# EAGLE design Iridium_9603N_Solar_Beacon (EAGLE 9.2.2)

## Sheet 1 of 4
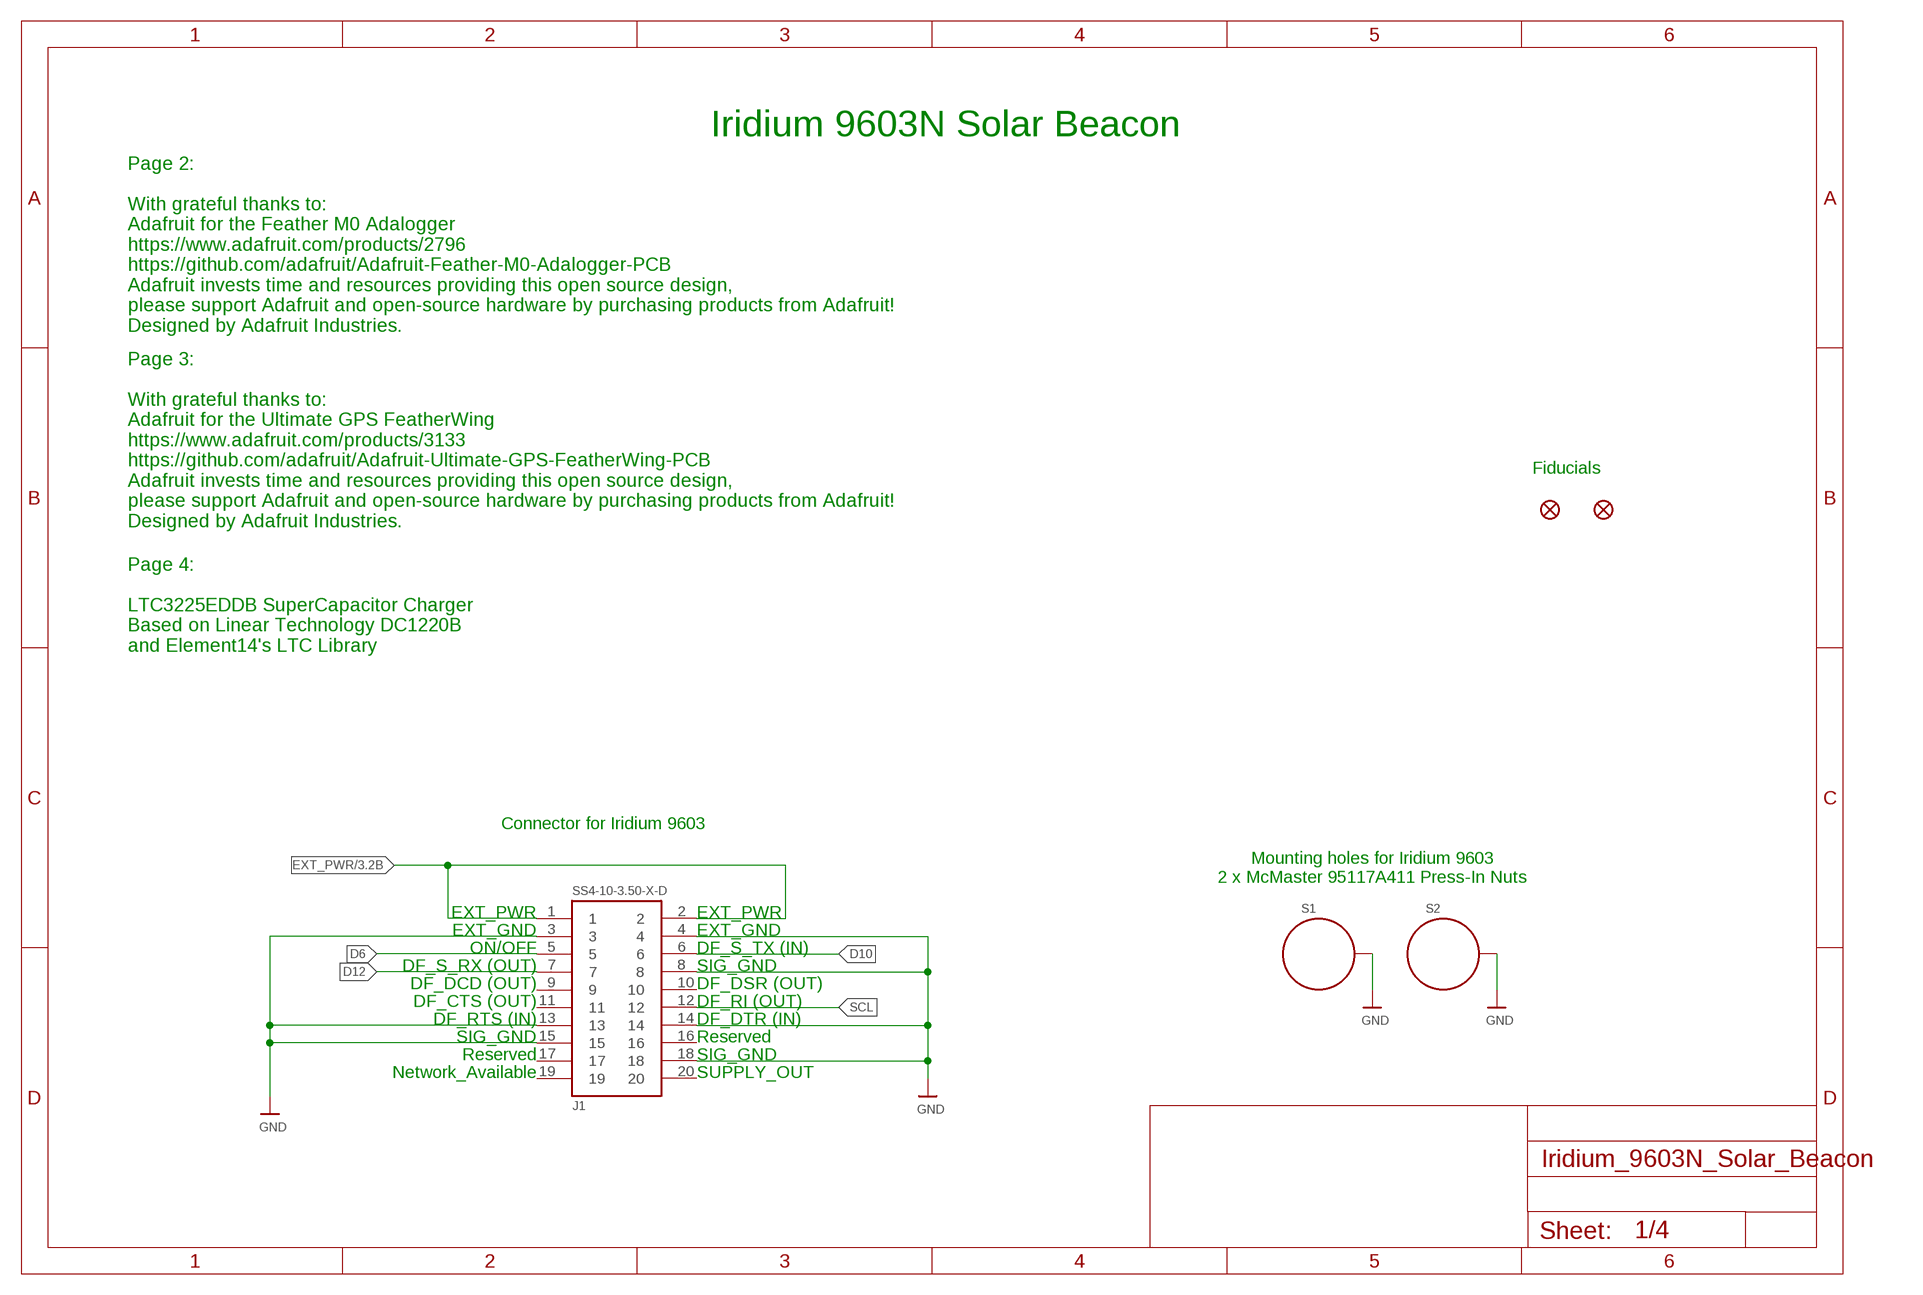
[diagram p0: schematic, sheet 1]

### Parts
FD1  FIDUCIAL1X2  [FIDUCIAL-1X2]
FD2  FIDUCIAL1X2  [FIDUCIAL-1X2]
J1  SS4-10-3.50-X-D  [SS4-10-3.50-X-D]
S1  STANDOFF_ELECTRICALMCMASTER-95117A411  [STANDOFF-ELECTRICAL-MCMASTER-95117A411]
S2  STANDOFF_ELECTRICALMCMASTER-95117A411  [STANDOFF-ELECTRICAL-MCMASTER-95117A411]

### Nets
D6: J1.5 ; also sheet 2
D10: J1.6 ; also sheet 2
D12: J1.7 ; also sheet 2
EXT_PWR: J1.1 J1.2 ; also sheet 3,4
GND: J1.3 J1.4 J1.8 J1.13 J1.14 J1.15 J1.18 S1.P1 S2.P1 ; also sheet 2,3,4
SCL: J1.12 ; also sheet 2
Unconnected: J1.9 J1.10 J1.11 J1.16 J1.17 J1.19 J1.20

### Notes on the sheet
- Iridium 9603N Solar Beacon
- Page 2:
  
  With grateful thanks to:
  Adafruit for the Feather M0 Adalogger
  https://www.adafruit.com/products/2796
  https://github.com/adafruit/Adafruit-Feather-M0-Adalogger-PCB
  Adafruit invests time and resources providing this open source design,
  please support Adafruit and open-source hardware by purchasing products from Adafruit!
  Designed by Adafruit Industries.
- Fiducials
- Page 3:
  
  With grateful thanks to:
  Adafruit for the Ultimate GPS FeatherWing
  https://www.adafruit.com/products/3133
  https://github.com/adafruit/Adafruit-Ultimate-GPS-FeatherWing-PCB
  Adafruit invests time and resources providing this open source design,
  please support Adafruit and open-source hardware by purchasing products from Adafruit!
  Designed by Adafruit Industries.
- Page 4:
  
  LTC3225EDDB SuperCapacitor Charger
  Based on Linear Technology DC1220B
  and Element14's LTC Library
- Connector for Iridium 9603
- Mounting holes for Iridium 9603
  2 x McMaster 95117A411 Press-In Nuts
- EXT_PWR | EXT_PWR
- EXT_GND | EXT_GND
- ON/OFF | DF_S_TX (IN)
- DF_S_RX (OUT) | SIG_GND
- DF_DCD (OUT) | DF_DSR (OUT)
- DF_CTS (OUT) | DF_RI (OUT)
- DF_RTS (IN) | DF_DTR (IN)
- SIG_GND | Reserved
- Reserved | SIG_GND
- Network_Available | SUPPLY_OUT

## Sheet 2 of 4
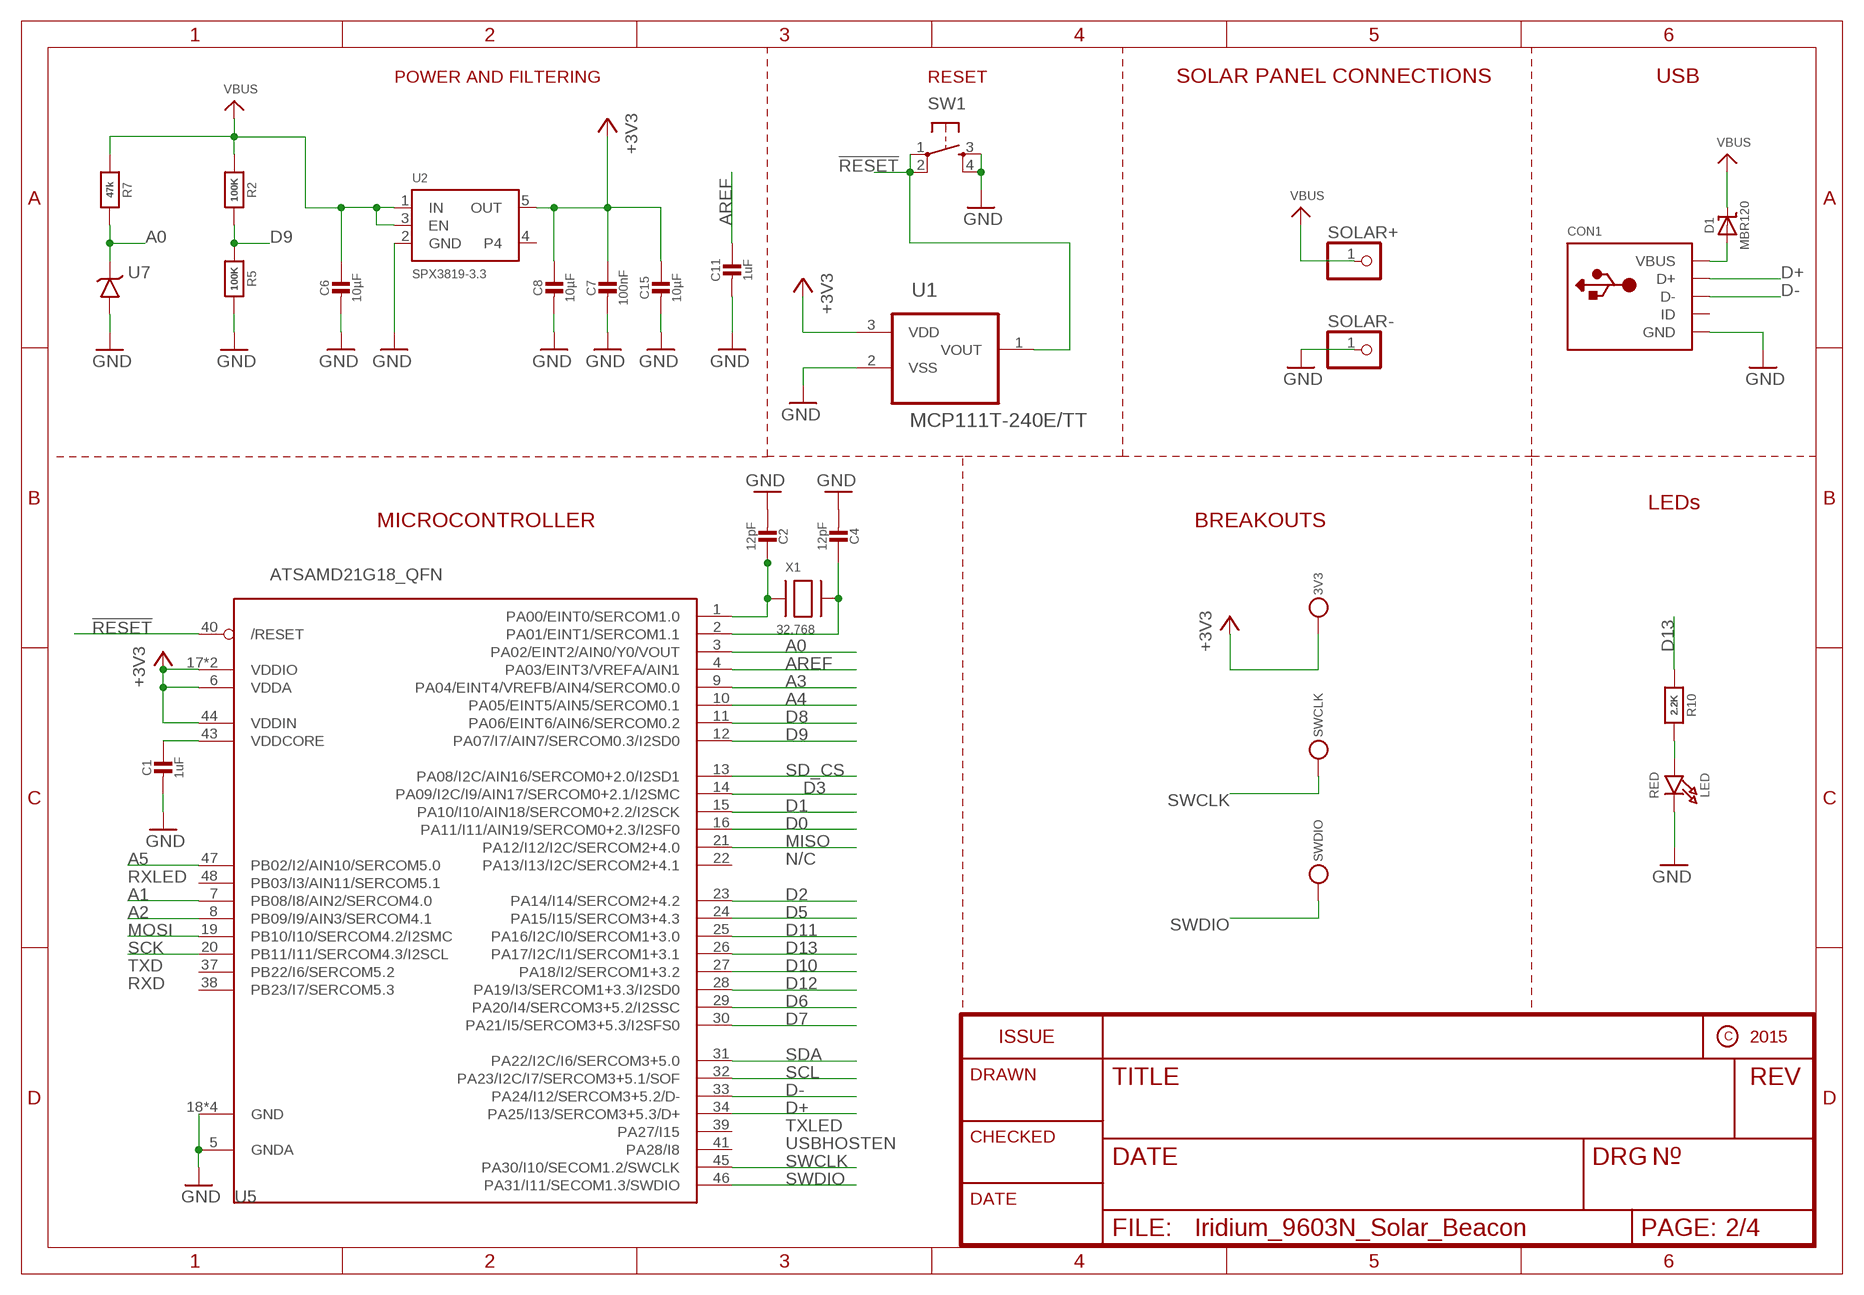
[diagram p1: schematic, sheet 2]

### Parts
3V3  TESTPOINTROUND1.5MM  [TESTPOINT_ROUND_1.5MM]
C1  1uF  CAP_CERAMIC0603_NO  [0603-NO]
C2  12pF  CAP_CERAMIC0603_NO  [0603-NO]
C4  12pF  CAP_CERAMIC0603_NO  [0603-NO]
C6  10µF  CAP_CERAMIC0805-NOOUTLINE  [0805-NO]
C7  100nF  CAP_CERAMIC0603_NO  [0603-NO]
C8  10µF  CAP_CERAMIC0805-NOOUTLINE  [0805-NO]
C11  1uF  CAP_CERAMIC0603_NO  [0603-NO]
C15  10µF  CAP_CERAMIC0805-NOOUTLINE  [0805-NO]
CON1  MICROBUILDER_USBFCI_10103594_CORRECTED  [MICROBUILDER_FCI_10103594_CORRECTED]
D1  MBR120  DIODE-SCHOTTKYSOD-123  [SOD-123]
LED  RED  LED0805_NOOUTLINE  [CHIPLED_0805_NOOUTLINE]
R2  100K  RESISTOR_0603_NOOUT  [0603-NO]
R5  100K  RESISTOR_0603_NOOUT  [0603-NO]
R7  47k  RESISTOR_0603_NOOUT  [0603-NO]
R10  2.2K  RESISTOR_0603_NOOUT  [0603-NO]
SOLAR+  PINHD-1X1  [1X01]
SOLAR-  PINHD-1X1  [1X01]
SW1  SWITCH_SPST_4_PINRECT  [TACTILE_SWITCH_SMD_4.6X2.8MM]
SWCLK  TESTPOINTROUND1.5MM  [TESTPOINT_ROUND_1.5MM]
SWDIO  TESTPOINTROUND1.5MM  [TESTPOINT_ROUND_1.5MM]
U1  MCP111T-240E/TT  MCP111T-270E/TT  [SOT95P237X112-3N]
U2  SPX3819-3.3  VREG_SOT23-5  [SOT23-5]
U5  ATSAMD21G18_QFN  ATSAMD21J_QFN  [TQFN48_7MM]
U7  LT1634-1,25BMCMS8  [MSOP8]
X1  32.768  XTAL-3.2X1.5  [XTAL3215]

### Nets
!RESET: SW1.1 SW1.2 U1.1(VOUT) U5.40(/RESET)
+3V3: 3V3.P$1 C7.1 C8.1 C15.1 U1.3(VDD) U2.5(OUT) U5.6(VDDA) U5.17(VDDIO) U5.36(VDDIO) U5.44(VDDIN) ; also sheet 3,4
A0: R7.2 U5.3(PA02/EINT2/AIN0/Y0/VOUT) U7.6(VOUT)
A1: U5.7(PB08/I8/AIN2/SERCOM4.0) ; also sheet 4
A2: U5.8(PB09/I9/AIN3/SERCOM4.1)
A3: U5.9(PA04/EINT4/VREFB/AIN4/SERCOM0.0)
A4: U5.10(PA05/EINT5/AIN5/SERCOM0.1)
A5: U5.47(PB02/I2/AIN10/SERCOM5.0)
AREF: C11.1 U5.4(PA03/EINT3/VREFA/AIN1)
D0: U5.16(PA11/I11/AIN19/SERCOM0+2.3/I2SF0) ; also sheet 3
D1: U5.15(PA10/I10/AIN18/SERCOM0+2.2/I2SCK) ; also sheet 3
D2: U5.23(PA14/I14/SERCOM2+4.2)
D3: U5.14(PA09/I2C/I9/AIN17/SERCOM0+2.1/I2SMC)
D5: U5.24(PA15/I15/SERCOM3+4.3) ; also sheet 4
D6: U5.29(PA20/I4/SERCOM3+5.2/I2SSC) ; also sheet 1
D7: U5.30(PA21/I5/SERCOM3+5.3/I2SFS0)
D8: U5.11(PA06/EINT6/AIN6/SERCOM0.2)
D9: R2.2 R5.1 U5.12(PA07/I7/AIN7/SERCOM0.3/I2SD0)
D10: U5.27(PA18/I2/SERCOM1+3.2) ; also sheet 1
D11: U5.25(PA16/I2C/I0/SERCOM1+3.0) ; also sheet 3
D12: U5.28(PA19/I3/SERCOM1+3.3/I2SD0) ; also sheet 1
D13: R10.1 U5.26(PA17/I2C/I1/SERCOM1+3.1)
D+: CON1.D+ U5.34(PA25/I13/SERCOM3+5.3/D+)
D-: CON1.D- U5.33(PA24/I12/SERCOM3+5.2/D-)
GND: C1.2 C2.2 C4.2 C6.2 C7.2 C8.2 C11.2 C15.2 CON1.BASE@1(GND) CON1.BASE@2(GND) CON1.GND CON1.SPRT@1(GND) CON1.SPRT@2(GND) CON1.SPRT@3(GND) CON1.SPRT@4(GND) LED.C R5.2 SOLAR-.1 SW1.3 SW1.4 U1.2(VSS) U2.2(GND) U5.5(GNDA) U5.18(GND) U5.35(GND) U5.42(GND) U5.THERMAL(GND) U7.4(GND) ; also sheet 1,3,4
MISO: U5.21(PA12/I12/I2C/SERCOM2+4.0) ; also sheet 4
MOSI: U5.19(PB10/I10/SERCOM4.2/I2SMC)
N$3: LED.A R10.2
N$5: C2.1 U5.1(PA00/EINT0/SERCOM1.0) X1.P$1
N$7: C4.1 U5.2(PA01/EINT1/SERCOM1.1) X1.P$2
N$16: CON1.VBUS D1.A
SCK: U5.20(PB11/I11/SERCOM4.3/I2SCL)
SCL: U5.32(PA23/I2C/I7/SERCOM3+5.1/SOF) ; also sheet 1
SD_CS: U5.13(PA08/I2C/AIN16/SERCOM0+2.0/I2SD1)
SDA: U5.31(PA22/I2C/I6/SERCOM3+5.0)
SWCLK: SWCLK.P$1 U5.45(PA30/I10/SECOM1.2/SWCLK)
SWDIO: SWDIO.P$1 U5.46(PA31/I11/SECOM1.3/SWDIO)
VBUS: C6.1 D1.C R2.1 R7.1 SOLAR+.1 U2.1(IN) U2.3(EN) ; also sheet 4
VDDCORE1: C1.1 U5.43(VDDCORE)
Unconnected: CON1.ID U2.4 U5.22(PA13/I13/I2C/SERCOM2+4.1) U5.37(PB22/I6/SERCOM5.2) U5.38(PB23/I7/SERCOM5.3) U5.39(PA27/I15) U5.41(PA28/I8) U5.48(PB03/I3/AIN11/SERCOM5.1)

### Notes on the sheet
- POWER AND FILTERING | RESET | SOLAR PANEL CONNECTIONS | USB
- LEDs
- MICROCONTROLLER | BREAKOUTS
- N/C
- RXLED
- TXD
- RXD
- TXLED
- USBHOSTEN

## Sheet 3 of 4
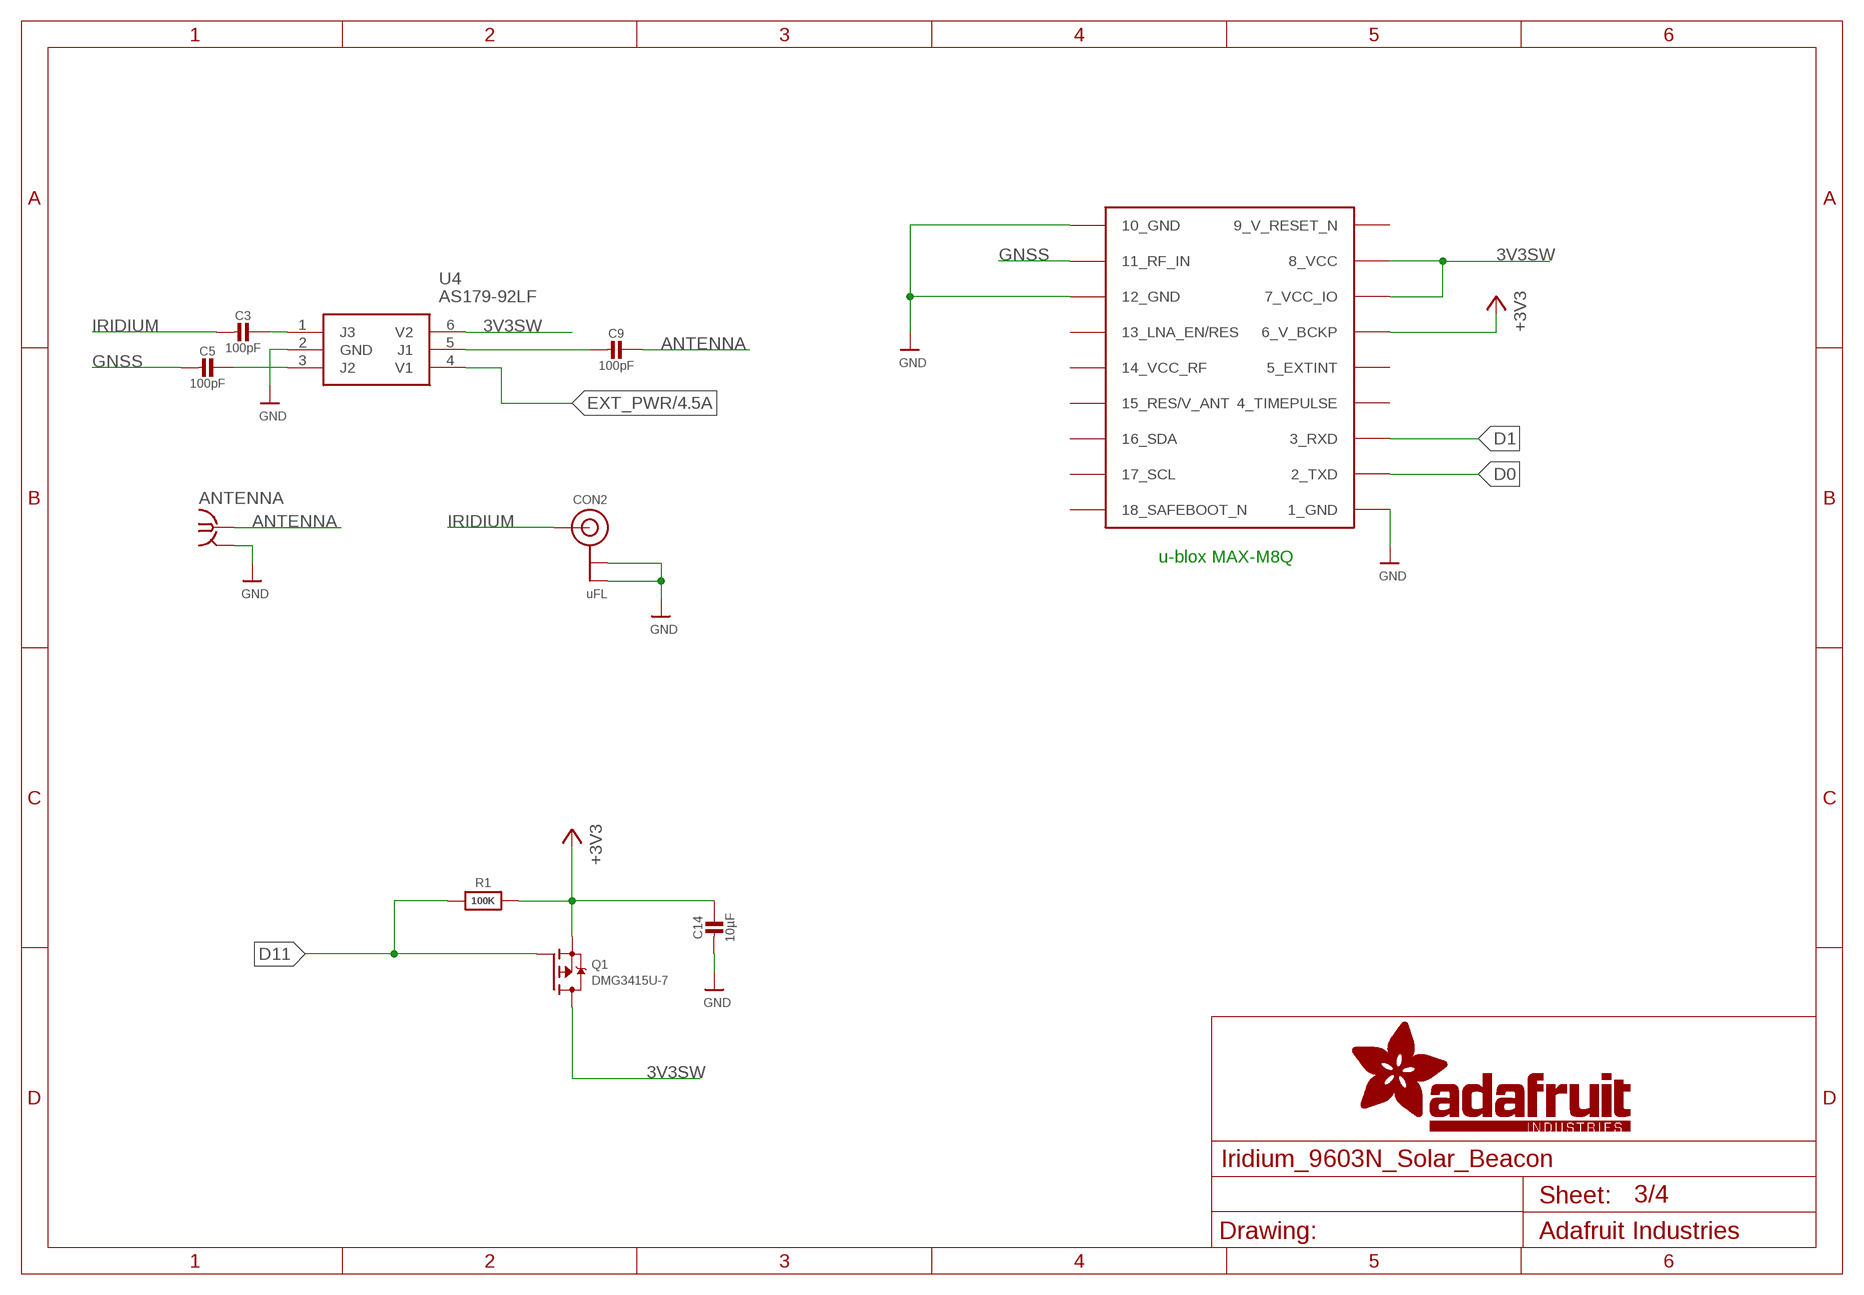
[diagram p2: schematic, sheet 3]

### Parts
ANTENNA  SMA-142-0711-821/826  [J502-ND-142-0711-821/826]
C3  100pF  CAP_CERAMIC0603_NO  [0603-NO]
C5  100pF  CAP_CERAMIC0603_NO  [0603-NO]
C9  100pF  CAP_CERAMIC0603_NO  [0603-NO]
C14  10µF  CAP_CERAMIC0805-NOOUTLINE  [0805-NO]
CON2  uFL  ANTENNA_U.FL  [U.FL]
Q1  DMG3415U-7  MOSFET-PWIDE  [SOT23-WIDE]
R1  100K  RESISTOR_0603_NOOUT  [0603-NO]
U4  AS179-92LF  [SOT65P220X100-6N]
U6  MAX-M8  [MAX-M8]

### Nets
3V3SW: Q1.3(D) U4.6(V2) U6.7_VCC_IO U6.8_VCC
+3V3: C14.1 Q1.2(S) R1.2 U6.6_V_BCKP ; also sheet 2,4
ANTENNA: ANTENNA.1 C9.1
D0: U6.2_TXD ; also sheet 2
D1: U6.3_RXD ; also sheet 2
D11: Q1.1(G) R1.1 ; also sheet 2
EXT_PWR: U4.4(V1) ; also sheet 1,4
GND: ANTENNA.G@1 ANTENNA.G@2 ANTENNA.G@3 ANTENNA.G@4 C14.2 CON2.1(GND) CON2.2(GND) U4.2(GND) U6.1_GND U6.10_GND U6.12_GND ; also sheet 1,2,4
GNSS: C5.2 U6.11_RF_IN
IRIDIUM: C3.2 CON2.3(SIGNAL)
N$1: C3.1 U4.1(J3)
N$2: C5.1 U4.3(J2)
N$4: C9.2 U4.5(J1)
Unconnected: U6.4_TIMEPULSE U6.5_EXTINT U6.13_LNA_EN(13_LNA_EN/RES) U6.14_VCC_RF U6.15_V_ANT/RESERVED(15_RES/V_ANT) U6.16_SDA U6.17_SCL U6.18_SAFEBOOT_N

### Notes on the sheet
- u-blox MAX-M8Q

## Sheet 4 of 4
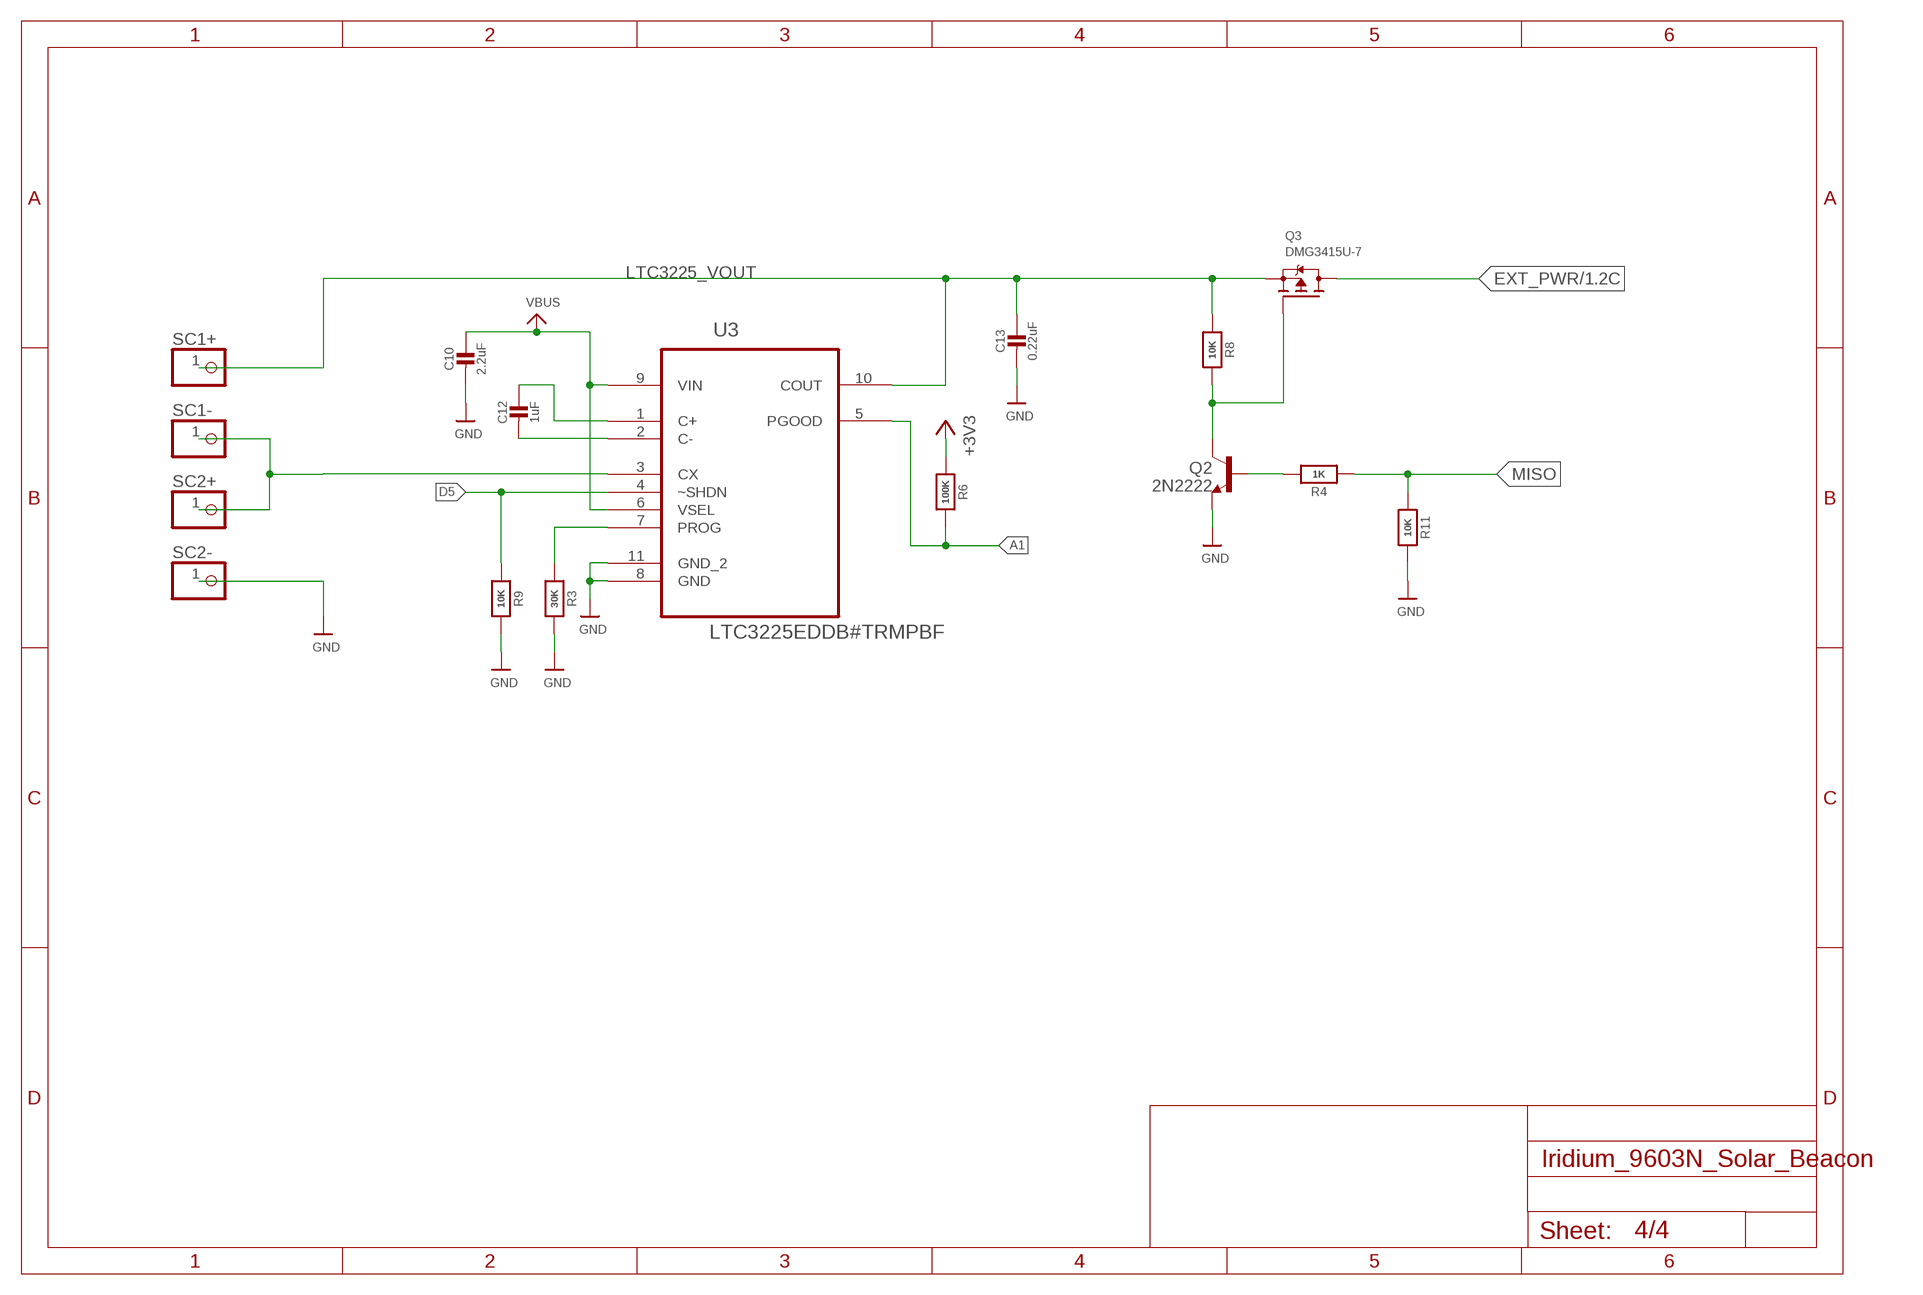
[diagram p3: schematic, sheet 4]

### Parts
C10  2.2uF  CAP_CERAMIC0603_NO  [0603-NO]
C12  1uF  CAP_CERAMIC0603_NO  [0603-NO]
C13  0.22uF  CAP_CERAMIC0603_NO  [0603-NO]
Q2  2N2222  MMBT2222ALT1-NPN-SOT23-BEC  [SOT23-BEC]
Q3  DMG3415U-7  MOSFET-PWIDE  [SOT23-WIDE]
R3  30K  RESISTOR_0603_NOOUT  [0603-NO]
R4  1K  RESISTOR_0603_NOOUT  [0603-NO]
R6  100K  RESISTOR_0603_NOOUT  [0603-NO]
R8  10K  RESISTOR_0603_NOOUT  [0603-NO]
R9  10K  RESISTOR_0603_NOOUT  [0603-NO]
R11  10K  RESISTOR_0603_NOOUT  [0603-NO]
SC1+  PINHD-1X1  [1X01]
SC1-  PINHD-1X1  [1X01]
SC2+  PINHD-1X1  [1X01]
SC2-  PINHD-1X1  [1X01]
U3  LTC3225EDDB#TRMPBF  LTC3225EDDB-TRMPBFDFN300X200-10L  [DFN300X200-10L]

### Nets
+3V3: R6.1 ; also sheet 2,3
A1: R6.2 U3.5(PGOOD) ; also sheet 2
D5: R9.1 U3.4(~SHDN) ; also sheet 2
EXT_PWR: Q3.3(D) ; also sheet 1,3
GND: C10.2 C13.2 Q2.E R3.2 R9.2 R11.2 SC2-.1 U3.8(GND) U3.11(GND_2) ; also sheet 1,2,3
LTC3225_VOUT: C13.1 Q3.2(S) R8.1 SC1+.1 U3.10(COUT)
MISO: R4.1 R11.1 ; also sheet 2
N$6: SC1-.1 SC2+.1 U3.3(CX)
N$9: C12.2 U3.2(C-)
N$10: C12.1 U3.1(C+)
N$11: R3.1 U3.7(PROG)
N$19: Q2.C Q3.1(G) R8.2
N$20: Q2.B R4.2
VBUS: C10.1 U3.6(VSEL) U3.9(VIN) ; also sheet 2

## Power pins joined to a net without a drawn wire
9_V_RESET_N: U6.9_RESET_N(9_V_RESET_N)

## Library data of the parts
3V3 SWCLK SWDIO = microbuilder:TESTPOINT: Test Point Various test points for characterisation and PCB testing TESTPOINT_SMT - Compact Surface Mount Test Point [Digikey: 5016KTR-ND]
ANTENNA = con-coax:SMA-: SMA 50 Ohm End Launch Jack Receptacle - Round Contact Johnson Components Source: www.johnsoncomponents.com .. J502-ND.pdf; MF: JOHNSON COMPONENTS; MPN: 142-0711-821; OC_FARNELL: 1019328; OC_NEWARK: 16F3627
C1-C15 = microbuilder:CAP_CERAMIC: Ceramic Capacitors For new designs, use the packages preceded by an '_' character since they are more reliable: The following footprints should be used on most boards: _0402 - Standard footprint for regular board layouts _0603 - Standard footprint for regular board layouts _0805 - Standard footprint for regular board layouts _1206 - Standard footprint for regular board layouts For extremely tight-pitch boards where space is at a premium, the following 'micro-pitch' footprints can be used (smaller pads, no silkscreen outline, etc.): _0402MP - Micro-pitch footprint for very dense/compact boards _0603MP - Micro-pitch footprint for very dense/compact boards _0805MP - Micro-pitch footprint for very dense/compact boards _1206MP - Micro-pitch footprint for very dense/compact boards
CON1 = Iridium_9603_Beacon:MICROBUILDER_USB: USB Connectors USBMINIB - Surface Mount Female Mini-B USB Connector 4UConnector: 06564
CON2 = microbuilder:ANTENNA_U.FL: U.FL Antenna Connector
D1 = microbuilder:DIODE-SCHOTTKY
FD1 FD2 = SparkFun-Aesthetics:FIDUCIAL: Fiducial Alignment Points Various fiducial points for machine vision alignment.
J1 = SS4-10-3.50-X-D:SS4-10-3.50-X-D: 0.4mm[.016] SOCKET STRIP ASSEMBLY.
LED = microbuilder:LED: LED 0603 - 0603 Surface Mount Package 2mA: Green LED - Low Power (3.9mcd, 2ma, 1.7Vf) - Digikey: 475-2709-2-ND Orange LED - Low Power (9.8mcd, 2ma, 1.8Vf) - Digikey: 475-1194-2-ND Red LED - Low Power (5mcd, 2ma, 1.8Vf) - Digikey: 475-1195-2-ND Yellow LED - Low Power (7mcd, 2ma, 1.8Vf) - Digikey: 475-1196-2-ND 5mA: Blue LED - Low Power (17mcd, 5ma, 2.9Vf) - Digikey: LNJ937W8CRACT-ND 0805 - 0805 Surface Mount Package 2mA: Red LED (8.8mcd, 2mA, 1.8Vf, Clear) - Low Power [Digikey: 475-2510-1-ND] Green LED (5mcd, 2mA, 1.8Vf, Clear) - Low Power [Digikey: 475-2730-1-ND] Yellow LED (11.3mcd, 2mA, 1.8Vf, Clear) - Low Power [Digikey: 475-2555-1-ND] 20mA: Red LED (104mcd, 20mA, Diffused) - LS R976 [Digikey: 475-1278-6-ND] Red LED (12mcd, 20mA, 2.0Vf, Clear) - APT2012EC [Digikey: 754-1128-1-ND] Green LED (15mcd, 20mA, 2.2Vf, Clear) - APT2012GC [Digikey: 754-1131-1-ND] Orange LED (160mcd, 20mA, 2.1Vf, Clear) - APT2012SECK [Digikey: 754-1130-1-ND] 1206 - 1206 Surface Mount Package Green LED (26mcd, 20mA, Diffused) - LG N971 [Digikey: 475-1407-6-ND] Red LED (15mcd, 20mA, Diffused) - LH N974 [Digikey: 475-1416-6-ND] Cree - Cree High-Power Surface Mount LEDs XPEBWT-L1-0000-00D50 - White 111lm 350mA 2.9Vf 6200K 110° XTEAWT-00-0000-00000LEE3 - White 114lm 350mA 2.85Vf 5000K 115° Everlight - Everlight 45-21 Series Surface Mount LEDs 45-21/QK2C-B2832AC2CB2/2T - Warm White 2000mcd 20mA 3.25Vf 3050K 120° 45-21/LK2C-B38452C4CB2/2T - Nuetral White 2000mcd 20mA 3.25Vf 4150K 120° 45-21/LK2C-B50634C6CB2/2T - Cold White 2200mcd 20mA 3.25Vf 5650K 120° PLCC2 Reverse Mount LS T77K-J1L2-1-0-2-R18-Z - Red 11.25mcd 2mA 1.8Vf 630nm 120° LO T77K-L1M2-24-Z - Orange 19.6mcd 2mA 1.8Vf 606nm 120° LY T77K-K2M1-26-Z - Yellow 15.7mcd 2mA 1.8Vf 587nm 120°
Q1 Q3 = microbuilder:MOSFET-P: P-Channel Mosfet LEGEND VDS: Voltage Drain-Source ID: Drain Current RDS(ON): Drain-Source On-State Resistance VGS(TH): Gate-Source Threshold Voltage CISS: Drain-Source Input Capacitance SOT-23 Name VDS ID RDS(ON) VGS(TH) CISS Order Number IRLML5103 30V 760mA 600 mOhm -- 75pF @ 25V Digikey: IRLML5103PBFCT-ND IRLML6401 12V 4.3A 50 mOhm 950mV @ 250µA 830pF @ 10V Digikey: IRLML6401PBFTR-ND NTR0202PL 20V 400mA 800 mOhm 2.3V @ 250uA 70pF @ 5V Digikey: NTR0202PLT1GOSTR-ND NTR4101PT1G 20V 1.8A 85 mOhm 1.2V @ 250uA 675pF @ 10V Digikey: NTR4101PT1GOSCT-ND DMP2004K 20V 600mA 900 mOhm 1V @ 250uA 175pF @ 16V Digikey: DMP2004KDICT-ND PMV65XP 20V 3.9A 76 mOhm 950mV @ 1mA 725pF @ 20V Digikey: 568-2358-2-ND TO-252 Name VDS ID RDS(ON) VGS(TH) CISS Order Number AOD417 30V 25A 34 mOhm 3V @ 250µA 920pF @ 15V Digikey: 785-1106-2-ND
Q2 = transistor:*-NPN-: NPN Transistror BF959 corrected 2008.03.06
R1-R11 = microbuilder:RESISTOR: Resistors For new designs, use the packages preceded by an '_' character since they are more reliable: The following footprints should be used on most boards: _0402 - Standard footprint for regular board layouts _0603 - Standard footprint for regular board layouts _0805 - Standard footprint for regular board layouts _1206 - Standard footprint for regular board layouts For extremely tight-pitch boards where space is at a premium, the following 'micro-pitch' footprints can be used (smaller pads, no silkscreen outline, etc.): _0402MP - Micro-pitch footprint for very dense/compact boards _0603MP - Micro-pitch footprint for very dense/compact boards _0805MP - Micro-pitch footprint for very dense/compact boards _1206MP - Micro-pitch footprint for very dense/compact boards
S1 S2 = SparkFun-Electromechanical:STANDOFF_ELECTRICAL: A standoff intended to be an electrically connected point.
SC1+ SC1- SC2+ SC2- SOLAR+ SOLAR- = adafruit:PINHD-1X1: Pin header 1x1 for 0.1" spacing With round pins
SW1 = SparkFun-Electromechanical:SWITCH_SPST_4_PIN; PROD_ID: SWCH-13065
U1 = Microchip-MCP11:MCP11: Micropower Voltage Detector ,SOT23-3;; MPN: MCP111T-240E/TT; OC_FARNELL: 1851877; OC_NEWARK: 56J7328; PACKAGE: SOT23-3; SUPPLIER: MICROCHIP
U2 = microbuilder:VREG_SOT23-5: SOT23-5 Fixed Voltage Regulators Part Current Out V Out V In V Dropout θJA (°C/W) TJ (°C) Digikey Part No. ADP121 150mA 3.3V 3.4-5.5V 0.09V @ 150mA -- -- ADP121-AUJZ33R7CT-ND ADP121 150mA 3.0V 3.1-5.5V 0.09V @ 150mA -- -- ADP121-AUJZ30R7CT-ND ADP122 300mA 3.3V 3.4-5.5V 0.085V @ 300mA -- -- ADP122AUJZ-3.3-R7CT-ND ADP1712 300mA 3.3V 3.5-5.5V 0.17V @ 300mA -- -- ADP1712AUJZ-3.3-R7TR-ND AP7311 (Low Cost) 150mA 3.3V 3.5-6V 0.15V @ 150mA -- -- AP7311-33WG-7DICT-ND LD39015M18R 150mA 1.8V 1.9V-5.5V 0.08V @ 100mA -- -- 497-6977-1-ND LP2985A-33DBVR 150mA 3.3V 3.3-16V 0.28V @ 150mA 206 150 296-18479-1-ND MCP1824T-3302E/OT 300mA 3.3V 3.5V-6V 0.2V @ 300mA -- -- MCP1824T-3302E/OTCT-ND MIC5205-2.5YM5 TR 150mA 2.5V 2.7-16V 0.165V @ 150mA -- -- 576-1257-2-ND MIC5205-3.0YM5 TR 150mA 3.0V 3.2V-16V 0.165V @ 150mA -- -- 576-1258-2-ND MIC5205-3.3YM5 TR 150mA 3.3V 3.5V-16V 0.165V @ 150mA -- -- 576-1259-2-ND TPS780330220 150mA 3.3V+2.2V 3.6-5.5V 250mV Max -- -- 296-23332-1-ND TDA3663/N1,135 100mA 3.3V 3.5-45V 0.18V @ 50mA -- -- 568-5343-1-ND Max operating temp can be calculated using θJA, TJ (max junction temperature), and power in watts. Set the "Maximum Ambient Temperature" until it reaches TJ ("Max Junction Temperature"), which is the absolute limit for safe use of the regulator: Heat Sink Temperature Calculator <http://www.daycounter.com/Calculators/Heat-Sink-Temperature-Calculator.phtml> For example, With 12V source into a 3.3V LP2985 and a 30mA load, we are dissipating (12V-3.3V) * 0.03A = 0.261W. With a θJA of 206 °C/W, a TJ of 150°C, and 261mW we can safely use the chip without a heat sink up to 75°C (=147.1°C Junction Temperature).
U3 = LTC_By_element14_Batch_1:LTC3225EDDB-TRMPBF: 150mA Supercapacitor Charger
U4 = SamacSys_Parts:AS179-92LF: SKYWORKS SOLUTIONS - AS179-92LF - IC, SWITCH, RF, SPDT, 0.02-3.0GHZ Source: Datasheet <http://www.skyworksinc.com/uploads/documents/AS179_92LF_200176H.pdf>; ARROW_PART_NUMBER: AS179-92LF; DESCRIPTION: SKYWORKS SOLUTIONS - AS179-92LF - IC, SWITCH, RF, SPDT, 0.02-3.0GHZ; HEIGHT: 1mm; MANUFACTURER_NAME: Skyworks; MANUFACTURER_PART_NUMBER: AS179-92LF
U5 = microbuilder:ATSAMD21J
U6 = ubloxLib:MAX-M8: u-blox MAX GNSS module
U7 = linear-technology:LT1634: Micropower Precision Shunt Voltage Reference Source: Darta sheet <http://cds.linear.com/docs/en/datasheet/1634fe.pdf>
X1 = adafruit2:XTAL: Low cost SMT crystals, no capacitors included http://www.ladyada.net/library/eagle

## Board
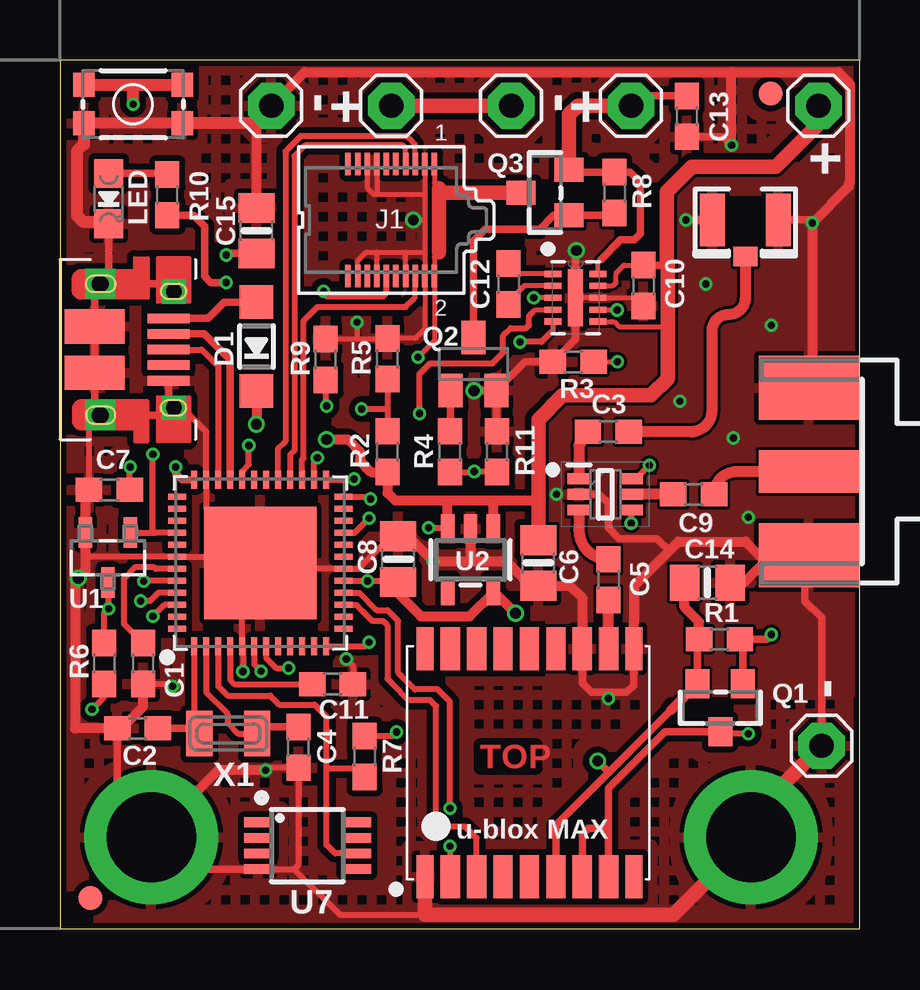
[diagram p4: board, top side]
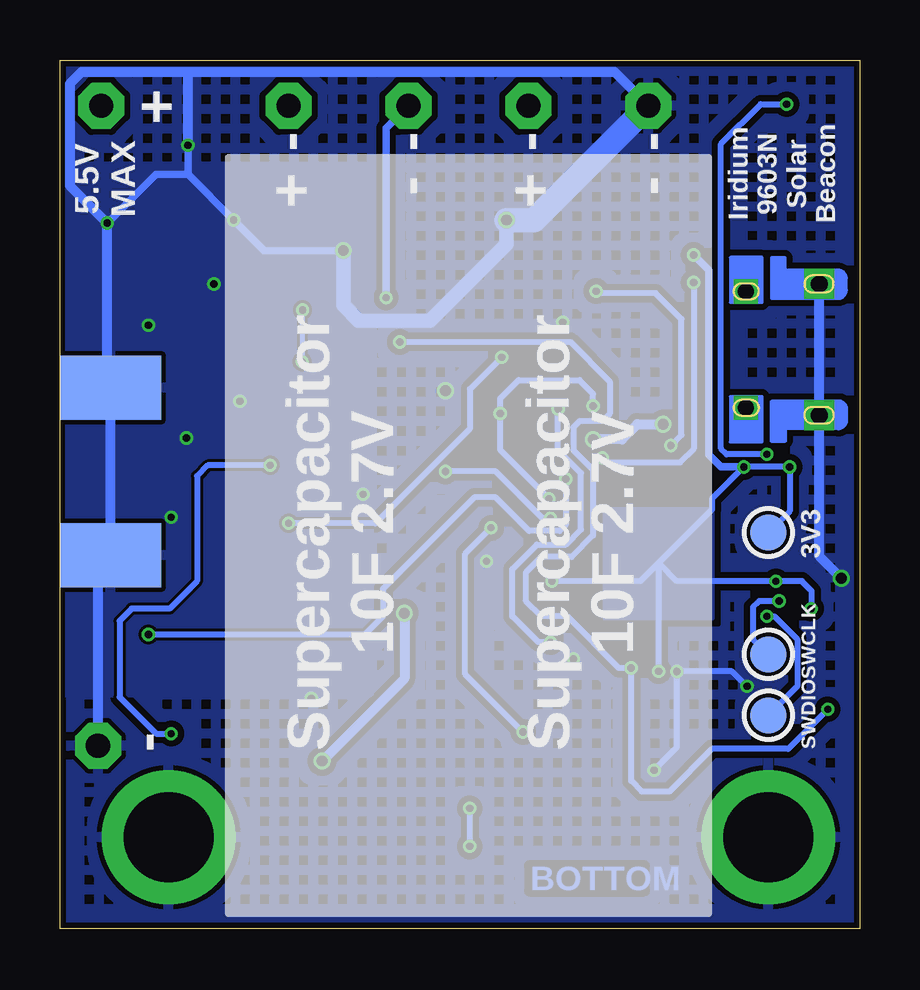
[diagram p5: board, bottom side, seen from below]

Size 33.34 x 36.2 mm. Coordinates in mm from the lower left corner, seen from the top.
Outline: 0,0 33.34,0 33.34,36.2 0,36.2 0,0
Copper layers (1*16): Top 0.018mm / dielectric 1.55mm / Bottom 0.018mm
Design rules "Multi-CB_2L_125um-Tracks_OL35um *": minimum track width 0.125mm, minimum drill 0.2mm, track to track 0.125mm, track to pad 0.125mm, pad to pad 0.125mm, via to via 0.125mm, smd to smd 0mil, copper to edge 0.2mm, drill to drill 0.2mm, minimum pad ring 0.125mm, minimum via ring 0.125mm, stop-mask expansion 2mil, vias tented up to drill 0.45mm, thermal gap 0.2mm

### Footprints (pad centres in the part's own frame; a part is rotated, then mirrored left to right if it is on the bottom)
TESTPOINT_ROUND_1.5MM = smd 1.5 x 1.5: P$1 0,0
J502-ND-142-0711-821/826 = smd 4.191 x 1.778: 1 2.115,0 | smd 4.191 x 2.667: G@1 2.115,3.495; G@2 2.115,-3.495 | smd 4.191 x 2.667 bottom: G@3 2.115,3.495; G@4 2.115,-3.495
0603-NO = smd 1.1 x 1: 1 -0.85,0; 2 0.85,0
0805-NO = smd 1.24 x 1.5: 1 -0.95,0; 2 0.95,0
MICROBUILDER_FCI_10103594_CORRECTED = smd 1.425 x 2.5: BASE@1 -0.963,1.45; BASE@2 0.963,1.45 | smd 0.4 x 1.75: D+ 0,4.525; D- -0.65,4.525; GND 1.3,4.525; ID 0.65,4.525; VBUS -1.3,4.525 | drill 0.7 pad 1.25 square: SPRT@1 -2.736,1.679; SPRT@2 2.736,1.679 | drill 0.65 pad 1.016 square: SPRT@3 -2.426,4.747; SPRT@4 2.426,4.747
U.FL = smd 2.2 x 1.05: 1 0,1.375; 2 0,-1.375 | smd 0.8 x 1: 3 1.525,0
SOD-123 = smd 1.4 x 1.4: A 1.85,0; C -1.85,0
FIDUCIAL-1X2 = smd 1 x 1: 1 0,0
SS4-10-3.50-X-D = smd 0.23 x 0.93: 1 1.8,2.335; 2 1.8,-2.335; 3 1.4,2.335; 4 1.4,-2.335; 5 1,2.335; 6 1,-2.335; 7 0.6,2.335; 8 0.6,-2.335; 9 0.2,2.335; 10 0.2,-2.335; 11 -0.2,2.335; 12 -0.2,-2.335; 13 -0.6,2.335; 14 -0.6,-2.335; 15 -1,2.335; 16 -1,-2.335; 17 -1.4,2.335; 18 -1.4,-2.335; 19 -1.8,2.335; 20 -1.8,-2.335
CHIPLED_0805_NOOUTLINE = smd 1.2 x 1.2: A 0,-1.05; C 0,1.05
SOT23-WIDE = smd 1 x 1.2: 1 -0.95,-1; 2 0.95,-1; 3 0,1
SOT23-BEC = smd 1 x 1.4: B -0.95,-1.1; C 0,1.1; E 0.95,-1.1
STANDOFF-ELECTRICAL-MCMASTER-95117A411 = drill 3.734 pad 5.588: P1 0,0
1X01 = drill 1.016 pad 1.93 octagon: 1 0,0
TACTILE_SWITCH_SMD_4.6X2.8MM = smd 0.9 x 1: 1 -2.05,-0.8; 2 2.05,-0.8; 3 2.05,0.8; 4 -2.05,0.8
SOT95P237X112-3N = smd 0.559 x 1.27: 1 -0.94,-1.041; 2 0.94,-1.041; 3 0,1.041
SOT23-5 = smd 0.55 x 1.2: 1 -0.95,-1.3; 2 0,-1.3; 3 0.95,-1.3; 4 0.95,1.3; 5 -0.95,1.3
DFN300X200-10L = smd 0.711 x 0.254: 1 -0.94,0.991; 2 -0.94,0.508; 3 -0.94,0; 4 -0.94,-0.508; 5 -0.94,-0.991; 6 0.94,-0.991; 7 0.94,-0.508; 8 0.94,0; 9 0.94,0.508; 10 0.94,0.991 | smd 0.635 x 2.388: 11 0,0
SOT65P220X100-6N = smd 0.95 x 0.45: 1 -1.1,0.65; 2 -1.1,0; 3 -1.1,-0.65; 4 1.1,-0.65; 5 1.1,0; 6 1.1,0.65
TQFN48_7MM = smd 0.25 x 0.75: 1 -2.75,-3.475; 2 -2.25,-3.475; 3 -1.75,-3.475; 4 -1.25,-3.475; 5 -0.75,-3.475; 6 -0.25,-3.475; 7 0.25,-3.475; 8 0.75,-3.475; 9 1.25,-3.475; 10 1.75,-3.475; 11 2.25,-3.475; 12 2.75,-3.475; 25 2.75,3.475; 26 2.25,3.475; 27 1.75,3.475; 28 1.25,3.475; 29 0.75,3.475; 30 0.25,3.475; 31 -0.25,3.475; 32 -0.75,3.475; 33 -1.25,3.475; 34 -1.75,3.475; 35 -2.25,3.475; 36 -2.75,3.475 | smd 0.75 x 0.25: 13 3.475,-2.75; 14 3.475,-2.25; 15 3.475,-1.75; 16 3.475,-1.25; 17 3.475,-0.75; 18 3.475,-0.25; 19 3.475,0.25; 20 3.475,0.75; 21 3.475,1.25; 22 3.475,1.75; 23 3.475,2.25; 24 3.475,2.75; 37 -3.475,2.75; 38 -3.475,2.25; 39 -3.475,1.75; 40 -3.475,1.25; 41 -3.475,0.75; 42 -3.475,0.25; 43 -3.475,-0.25; 44 -3.475,-0.75; 45 -3.475,-1.25; 46 -3.475,-1.75; 47 -3.475,-2.25; 48 -3.475,-2.75 | smd 4.7 x 4.7: THERMAL 0,0
MAX-M8 = smd 1.8 x 0.7: 1_GND 4.95,-4.4; 9_RESET_N 4.95,4.3; 10_GND -4.55,4.3; 18_SAFEBOOT_N -4.55,-4.4 | smd 1.8 x 0.8: 2_TXD 4.95,-3.35; 3_RXD 4.95,-2.25; 4_TIMEPULSE 4.95,-1.15; 5_EXTINT 4.95,-0.05; 6_V_BCKP 4.95,1.05; 7_VCC_IO 4.95,2.15; 8_VCC 4.95,3.25; 11_RF_IN -4.55,3.25; 12_GND -4.55,2.15; 13_LNA_EN -4.55,1.05; 14_VCC_RF -4.55,-0.05; 15_V_ANT/RESERVED -4.55,-1.15; 16_SDA -4.55,-2.25; 17_SCL -4.55,-3.35
MSOP8 = smd 0.4 x 1.2: 1 -0.975,-2.05; 2 -0.325,-2.05; 3 0.325,-2.05; 4 0.975,-2.05; 5 0.975,2.05; 6 0.325,2.05; 7 -0.325,2.05; 8 -0.975,2.05
XTAL3215 = smd 1.1 x 1.9: P$1 1.2,0; P$2 -1.2,0

### Placement (x,y rotation side)
3V3  3.81,16.51 180 bottom
ANTENNA  33.34,19.05 180 top
C1  3.46,11.05 270 top
C2  3.24,8.35 180 top
C3  22.86,20.7 0 top
C4  9.94,7.56 270 top
C5  22.86,14.54 270 top
C6  19.94,15.24 270 top
C7  2.06,18.29 180 top
C8  14.1,15.4 90 top
C9  26.42,18.1 180 top
C10  24.32,26.8 270 top
C11  11.37,10.19 0 top
C12  18.7,26.86 270 top
C13  26.13,33.85 270 top
C14  26.99,14.41 0 top
C15  8.19,29.08 90 top
CON1  0,24.13 270 top
CON2  28.57,29.53 270 top
D1  8.19,24.26 90 top
FD1  1.27,1.27 0 top
FD2  29.62,34.8 0 top
J1  13.81,29.53 0 top
LED  2.03,30.42 180 top
Q1  27.53,9.21 180 top
Q2  17.24,23.53 0 top
Q3  20.22,30.67 90 top
R1  27.5,12.06 180 top
R2  13.65,19.88 90 top
R3  21.4,23.62 180 top
R4  16.26,19.88 90 top
R5  13.65,23.75 90 top
R6  1.84,11.05 270 top
R7  12.7,7.18 270 top
R8  23.11,30.67 270 top
R9  11.08,23.72 90 top
R10  4.48,30.58 90 top
R11  18.22,19.88 90 top
S1  3.81,3.81 0 top
S2  28.81,3.81 0 top
SC1+  23.81,34.29 0 top
SC1-  18.81,34.29 0 top
SC2+  13.81,34.29 0 top
SC2-  8.81,34.29 0 top
SOLAR+  31.62,34.29 0 top
SOLAR-  31.75,7.62 0 top
SW1  3.05,34.35 180 top
SWCLK  3.81,11.43 180 bottom
SWDIO  3.81,8.89 180 bottom
U1  2,15.46 180 top
U2  17.11,15.37 180 top
U3  21.49,26.29 0 top
U4  22.73,18.1 0 top
U5  8.35,15.24 0 top
U6  19.62,7.11 270 top
U7  10.32,3.46 270 top
X1  7.02,8.13 180 top

### Tracks (layer width: path | path; a pad name or v marks a point on that pad's centre or on a via)
3V3SW  (via drill 0.3)
  Top 0.254: v24.57,19.3 24.02,18.75 U4.6 | v28.7,8.13 27.61,8.13 Q1.3
  Top 0.305: U6.8_VCC 22.87,4.19 | 22.87,4.19 22.87,5.85 25.23,8.21 Q1.3 | U6.7_VCC_IO 21.77,3.93 22.04,4.19 22.87,4.19
  Bottom 0.254: v24.57,19.3 27.18,19.3 27.62,18.86 27.62,14.48 28.77,13.34 30.35,13.34 30.86,12.83 30.86,9.65 29.34,8.13 v28.7,8.13
!RESET  (via drill 0.3)
  Top 0.254: U5.40 3.96,16.49 3.94,16.5 | 3.94,16.5 3.87,16.57 v3.87,19.77 | U1.1 3.94,16.5
  Top 0.508: SW1.2 3.05,35.15 | 3.05,35.15 SW1.1 | v3.05,34.35 3.05,35.15
  Bottom 0.254: v3.87,19.77 5.54,19.77 5.78,20 5.78,32.7 4.13,34.35 v3.05,34.35
+3V3  (via drill 0.3, 0.45)
  Top 0.254: C8.1 14.06,14.49 v12.83,14.49 U5.17 | U5.44 3.5,14.49 v3.49,14.48 | U5.6 8.1,11.01 v8.38,10.73 | C7.1 v2.91,19.23 v2.92,19.24 | U1.3 2,13.37 v2.03,13.34 1.84,13.14 R6.1
  Top 0.305: U6.6_V_BCKP 20.67,4.3 22.89,6.51 | 22.89,6.51 25.49,9.12 | v22.42,6.99 22.89,6.51 | Q1.2 26.58,12 R1.2 | v6.92,28.07 6.99,28.13 C15.1 | U5.36 5.1,18.71 4.83,18.99 v4.83,19.24
  Top 0.406: 25.49,9.12 Q1.2 | C8.1 14.1,13.97 15.05,13.02 17.08,13.02 18.06,14 U2.5 v18.99,13.14 | v18.99,13.14 | R1.2 26.64,12.79 26.04,13.4 C14.1
  Bottom 0.254: 8.38,15.24 7.62,14.48 v3.49,14.48 2.41,14.48 2,14.06 2,13.37 v2.03,13.34 | v8.38,10.73 8.38,15.24 | v12.83,14.49 9.13,14.49 8.38,15.24 | 8.38,15.24 6.16,17.46 6.16,17.91 v4.83,19.24 v2.92,19.24 2.92,17.4 3V3.P$1
  Bottom 0.305: v4.83,19.24 5.78,19.24 6.29,19.75 6.29,27.43 v6.92,28.07
  Bottom 0.406: v18.99,13.14 18.99,10.41 v22.42,6.99
  pour Bottom: 6.1,17.49 10.67,17.49 10.67,12.92 6.1,12.92
A0
  Top 0.254: U5.3 6.6,10.1 6.99,9.72 8.76,9.72 9.14,9.34 10.6,9.34 11.11,8.83 11.11,6.67 | U7.6 11.47,3.14 11.11,3.49 11.11,6.67 | R7.2 12.36,6.67 11.11,6.67
A1  (via drill 0.3)
  Top 0.203: U3.5 20.55,24.94 20.45,24.83
  Top 0.254: 20.45,24.83 20.07,24.45 v19.18,24.45 | U5.7 8.6,11.28 9.02,10.86 v9.53,10.86 | R6.2 1.84,9.65 v1.33,9.14
  Bottom 0.254: v19.18,24.45 12.06,24.45 10.41,22.8 10.41,21.46 10.73,21.14 11.68,21.14 11.94,20.89 11.94,19.94 11.11,19.11 11.11,16.38 12,15.49 13.27,15.49 13.91,14.86 13.91,13.65 13.27,13.02 12.19,13.02 10.03,10.86 v9.53,10.86 9.53,6.16 9.08,5.71 7.94,5.71 6.16,7.49 2.98,7.49 v1.33,9.14
ANTENNA
  Top 0.457: C9.1 arc-90 28.22,19.05 ANTENNA.1
AREF
  Top 0.254: U5.4 7.1,10.36 7.27,10.19 C11.1
D0  (via drill 0.3)
  Top 0.254: U6.2_TXD 16.27,3.41 v16.26,3.43 | v16.26,5.02 16.26,9.46 15.75,9.97 14.8,9.97 14.22,10.54 14.1,10.67 14.1,12.83 13.65,13.27 13.21,13.27 12.49,13.99 U5.16
  Bottom 0.254: v16.26,3.43 v16.26,5.02
D1
  Top 0.254: U5.15 12.35,13.49 12.64,13.21 13.02,12.83 13.21,12.83 13.46,12.83 13.65,12.64 13.65,10.41 13.84,10.22 14.54,9.53 15.43,9.53 15.68,9.27 15.68,4.51 15.94,4.25 16.89,4.25 17.37,3.77 U6.3_RXD
D5  (via drill 0.3)
  Top 0.203: 19.68,25.65 19.81,25.78 U3.4
  Top 0.254: U5.24 12.87,17.99 v12.95,17.91 | v14.99,21.46 14.99,23.11 15.43,23.56 18.03,23.56 18.48,24 18.48,24.7 18.8,25.02 19.43,25.02 19.56,25.15 19.56,25.53 19.68,25.65 | R9.1 11.08,21.81 v11.11,21.78
  Bottom 0.254: v12.95,17.91 14.99,19.94 v14.99,21.46 14.99,22.1 14.22,22.86 11.68,22.86 11.11,22.29 v11.11,21.78
D6
  Top 0.203: J1.5 14.81,32.69 14.67,32.83
  Top 0.254: U5.29 9.1,20.02 9.4,20.32 9.4,32.38 10.03,33.02 14.48,33.02 14.67,32.83
D9  (via drill 0.3)
  Top 0.254: R5.1 13.65,21.59 | 13.65,21.59 R2.2 | v12.89,11.94 12.72,11.77 12.16,11.77 11.72,11.77 U5.12 | v12.57,21.65 13.59,21.65 13.65,21.59
  Bottom 0.254: v12.89,11.94 13.4,11.94 14.48,13.02 14.48,14.99 13.46,16 12.26,16 11.62,16.64 11.62,18.99 12.57,19.94 v12.57,21.65
D10
  Top 0.203: 14.73,26.23 14.81,26.3 J1.6
  Top 0.254: U5.27 10.1,19.56 10.16,19.62 10.16,25.34 10.73,25.91 14.41,25.91 14.73,26.23
D11  (via drill 0.3)
  Top 0.254: U5.25 12.24,18.71 v12.26,18.73
  Top 0.305: Q1.1 28.48,11.93 R1.1 29.46,12.06 v29.65,12.26
  Bottom 0.254: v12.26,18.73 12.26,16.83 12.51,16.57 13.78,16.57 15.18,17.97 16.07,17.97 19.88,14.16 19.88,13.02 20.64,12.26 v29.65,12.26
D12
  Top 0.203: J1.7 14.41,32.52 14.35,32.58
  Top 0.254: 14.35,32.58 14.29,32.64 10.23,32.64 9.78,32.19 9.78,19.94 9.6,19.76 U5.28
D13  (via drill 0.3)
  Top 0.254: U5.26 10.6,19.49 v10.73,19.62
  Top 0.305: R10.1 5.58,29.73 6.03,29.27 6.03,27.18 6.29,26.92 v6.92,26.92
  Bottom 0.254: v10.73,19.62 10.54,19.43 7.49,19.43 6.92,20 v6.92,26.92
D+
  Top 0.254: CON1.D+ 5.91,24.13 6.6,23.43 U5.34
D-
  Top 0.305: U5.33 7.1,23.7 6.02,24.78 CON1.D-
EXT_PWR  (via drill 0.3)
  Top 0.203: J1.1 15.61,31.06 15.81,30.86 | 15.81,28.19 15.61,27.99 J1.2 15.61,24.5 v14.92,23.81
  Top 0.254: v23.81,16.89 23.81,17.43 U4.4
  Top 0.61: 15.81,28.19 15.81,30.86 16,30.67 Q3.3
  Bottom 0.254: v14.92,23.81 16.26,22.48 16.26,20.83 20.19,16.89 v23.81,16.89
GND  (via drill 0.3, 0.45)
  Top 0.203: J1.3 15.21,30.61 | 15.21,30.61 15.21,29.53 | 15.21,29.53 15.21,28.19 | 15.21,28.19 J1.4 15.21,24.99 14.82,24.6 R5.2 13.62,24.57 12.38,24.57 R9.2 | U3.11 U3.8 23.98,26.29 C10.2 | v14.73,29.53 15.21,29.53 | J1.18 12.41,27.84 12.76,28.19 13.21,28.19 | 13.21,28.19 14.41,28.19 | 14.41,28.19 15.21,28.19 | J1.14 13.21,28.19 | J1.8 14.41,28.19 | J1.15 12.81,30.88 13.08,30.61 13.21,30.61 | 13.21,30.61 15.21,30.61 | J1.13 13.21,30.61
  Top 0.254: U5.THERMAL 8.1,15.49 U5.42 1.06,15.49 | 8.27,15.16 7.6,14.49 U5.5 7.63,11.74 v7.63,10.72 | 8.27,15.16 U5.THERMAL | 8.27,15.16 8.44,14.99 U5.18 12.45,14.99 13.81,16.35 C8.2 | U5.THERMAL 6.1,17.49 U5.35 6.1,20.7 5.4,21.39 4.44,21.39 | U7.4 9.77,2.49 | 15.22,0.57 11.68,0.57 9.77,2.49 | 9.77,2.49 9.94,2.65 C4.2 8.68,6.71 v8.57,6.6 | v11.94,11.24 12.22,10.96 C11.2 | C7.2 1.21,20.93 CON1.SPRT@2 | C1.2 4.6,10.2 v4.7,10.1 | v12.38,25.27 12.38,24.57
  Top 0.305: v21.53,28.26 21.5,28.23 U3.11 21.5,24.57 R3.2 19.39,23.62 Q2.E | R11.2 18.19,20.76 Q2.E | CON1.SPRT@1 1.45,26.64 CON1.BASE@1 CON1.BASE@2 1.45,21.62 CON1.SPRT@2 4.44,21.39 CON1.SPRT@4 4.53,21.93 CON1.GND | CON1.SPRT@1 4.44,26.87 CON1.SPRT@3 | U7.4 5.13,2.49 S1.P1 2.39,5.23 C2.2 | U6.12_GND 21.77,10.23 22.16,9.84 22.86,9.84 | U6.10_GND 23.92,10.14 23.62,9.84 22.86,9.84 | SOLAR-.1 31.75,12.95 31.05,13.65 31.05,15.38 31.11,15.44 ANTENNA.G@3 | LED.C 2.03,27.22 CON1.SPRT@1 | Q2.E 18.18,22.42 v17.27,22.42 | U4.2 22.48,18.1 22.86,17.72 22.86,16.7 23.3,16.26 24.89,16.26 25.4,15.75 | v26.1,29.53 CON2.2 | CON2.1 31.24,29.53 v31.37,29.4 | C13.2 27.65,32.99 v28,32.64 | v22.86,9.59 22.86,9.84
  Top 0.406: C8.2 14.51,16.35 v15.56,15.3 17.08,15.3 | 17.08,15.3 18.61,15.3 19.62,14.29 C6.2 21.27,14.29 21.77,13.79 U6.12_GND | U2.2 17.11,15.34 17.08,15.3 | U6.10_GND 23.92,12.74 23.94,12.76 23.94,14.29 25.4,15.75 25.78,16.13 28.57,16.13 29.27,15.44 29.53,15.44 | 29.53,15.44 31.11,15.44 | ANTENNA.G@2 31.37,22.69 v31.37,29.4 32.89,30.92 32.89,31.05 32.93,31.09 32.93,35.2 32.45,35.69 27.98,35.69 | v8.57,6.6 6.6,6.6 S1.P1 | C7.2 1.06,18.14 U1.2 1.06,15.49 1.06,14.9 v0.76,14.61 0.64,14.48 0.64,8.35 C2.2 2.57,8.35 3.46,9.24 C1.2 | C14.2 28.5,14.41 29.53,15.44 | C15.2 8.19,33.44 8.07,33.55 | SC2-.1 10.21,35.69 27.98,35.69 | 27.98,35.69 27.98,32.66 v28,32.64
  Top 0.457: SW1.4 SW1.3
  Top 0.508: SC2-.1 8.07,33.55 SW1.4 | SW1.3 1,32.68 0.7,32.38 0.7,29.72 0.95,29.46 1.94,29.46 LED.C
  Top 0.61: U6.1_GND 15.22,0.57 25.57,0.57 S2.P1 28.81,4.68 SOLAR-.1
  Bottom 0.254: v8.57,6.6 7.63,7.55 v7.63,10.72 5.32,10.72 v4.7,10.1
  Bottom 0.305: v28,32.64 28,31.43 | 28,31.43 v26.1,29.53 24.83,28.26 v21.53,28.26 | v31.37,29.4 29.34,31.43 28,31.43
  Bottom 0.406: SOLAR-.1 31.75,15.03 ANTENNA.G@3 ANTENNA.G@2 31.37,22.69 v31.37,29.4 32.93,30.97 32.93,35.2 32.45,35.69 28,35.69 | v0.76,14.61 1.68,15.52 CON1.SPRT@2 CON1.SPRT@1 | SC2-.1 10.21,35.69 28,35.69 | v28,32.64 28,35.69
  Bottom 0.61: v14.73,29.53 14.73,28.51 17.91,25.34 20.89,25.34 21.53,25.97 v21.53,28.26
  Bottom 1.016: SC2-.1 13.57,29.53 v14.73,29.53
  other vias: 20.7,18.1 25.84,21.97 28.07,20.45 28.7,17.14 29.65,25.15 26.92,26.86
  pour Bottom (isolate 0.254, rank 2, hatched): 0,0 0,36.2 33.34,36.2 33.34,0
  pour Top (isolate 0.254, rank 2, hatched): 0,0 0,36.2 33.34,36.2 33.34,0
  pour Top (isolate 0.102): 20.45,31.75 33.34,31.75 33.34,9.84 20.45,9.84
  pour Bottom (isolate 0.102): 20.45,31.75 33.34,31.75 33.34,9.84 20.45,9.84
GNSS
  Top 0.457: U6.11_RF_IN 22.87,13.68 arc90 C5.2
IRIDIUM
  Top 0.457: C3.2 26.29,20.7 arc90 27.18,21.59 27.18,24.89 arc-90 27.88,25.59 arc90 28.57,26.29 CON2.3
LTC3225_VOUT
  Top 0.203: U3.10 22.43,27.77 22.54,27.88
  Top 0.305: 22.54,27.88 23.37,28.7 23.94,28.7 24.19,28.96 24.19,31.11 23.79,31.52 R8.1 21.32,31.52 Q3.2 | SC1+.1 24.21,34.7 C13.1
  Top 0.61: Q3.2 21.23,33.92 21.59,34.29 SC1+.1
MISO  (via drill 0.3)
  Top 0.254: U5.21 12.28,16.49 v12.89,17.1 | R11.1 18.2,19.05 v17.27,19.05 17.25,19.03 R4.1
  Bottom 0.254: v12.89,17.1 13.23,17.1 15.18,19.05 v17.27,19.05
N$1
  Top 0.457: C3.1 21.63,20.14 U4.1
N$2
  Top 0.457: U4.3 21.63,16.62 arc90 C5.1
N$3
  Top 0.305: LED.A 4.44,31.47 R10.2
N$4
  Top 0.457: C9.2 U4.5
N$5
  Top 0.254: U5.1 5.6,8.35 X1.P$1
  Top 0.305: X1.P$1 5.59,8.35 C2.1
N$6  (via drill 0.3)
  Top 0.203: U3.3 v19.75,26.29
  Top 0.61: SC2+.1 SC1-.1
  Bottom 0.305: v19.75,26.29 19.75,33.35 SC1-.1
N$7
  Top 0.254: U5.2 6.1,9.84 6.99,8.95 6.99,8.57 7.43,8.13 X1.P$2
  Top 0.305: X1.P$2 8.49,8.41 C4.1
N$9
  Top 0.203: U3.2 19.37,26.8 18.7,26.13 C12.2
N$10
  Top 0.203: U3.1 19.13,27.28 C12.1
N$11  (via drill 0.3)
  Top 0.203: U3.7 v23.23,25.78 | R3.1 v23.24,23.62
  Bottom 0.203: v23.24,23.62 23.23,23.63 v23.23,25.78
N$16
  Top 0.305: D1.A 6.85,26.11 6.18,25.43 CON1.VBUS
N$19
  Top 0.305: R8.2 23.01,29.72 Q3.1 20.58,29.72 20,29.15 17.72,29.15 17.24,28.67 Q2.C
N$20
  Top 0.305: Q2.B 16.29,20.76 R4.2
SCL  (via drill 0.3)
  Top 0.254: U5.32 7.6,19.07 7.87,19.34 v7.87,20.13 | v10.99,26.56 10.99,26.52 11.16,26.35 13.46,26.35 13.61,26.5 J1.12
  Bottom 0.254: v7.87,20.13 7.43,20.57 7.43,25.4 8.51,26.48 10.9,26.48 v10.99,26.56
SWCLK  (via drill 0.3)
  Top 0.254: U5.45 4.08,13.99 3.75,13.65 v3.37,13.65
  Bottom 0.254: v3.37,13.65 4.19,13.65 4.45,13.4 4.45,12.06 SWCLK.P$1
SWDIO  (via drill 0.3)
  Top 0.254: U5.46 4.35,13.49 v3.87,13.02
  Bottom 0.254: v3.87,13.02 3.56,13.02 2.6,12.06 2.6,10.1 SWDIO.P$1
VBUS  (via drill 0.3, 0.45)
  Top 0.203: U3.9 23.05,26.8 23.18,26.92 23.18,27.3 23.52,27.65 C10.1 | U3.6 23,25.3 23.02,25.28 23.11,25.28 23.3,25.08 25.27,25.08 25.34,25.15
  Top 0.254: v14.03,8.19 13.87,8.03 R7.1 | v15.37,16.7 16.13,16.7 U2.3
  Top 0.305: C10.1 25.31,27.65 25.34,27.62
  Top 0.406: 16.19,17.84 13.97,17.84 13.65,18.16 R2.1 12.98,19.03 12.51,19.49 12.51,19.88 12,20.38 v11.11,20.38 | 16.19,17.84 18.1,17.84 | 18.1,17.84 19.94,17.84 | U2.3 16.16,17.81 16.19,17.84 | U2.1 18.06,17.81 18.1,17.84 | D1.C v8.19,21.02
  Top 0.61: 25.34,27.62 25.34,25.15 25.34,22.92 24.64,22.23 20.95,22.23 19.94,21.21 19.94,17.84 C6.1 | SOLAR+.1 31.62,33.53 29.84,31.75 26.35,31.75 25.31,30.71 25.31,27.65
  Bottom 0.254: v14.03,8.19 16.45,10.6 16.45,15.62 v15.37,16.7
  Bottom 0.406: v11.11,20.38 9.91,20.38 9.27,21.02 v8.19,21.02
VDDCORE1
  Top 0.254: U5.43 4,14.99 3.94,15.05 3.11,15.05 2.67,14.61 2.67,12.69 C1.1

### Text on the board
Top: TOP
Bottom: BOTTOM
tPlace: - | - | + | + | + | -
bPlace: - | - | - | - | + | Iridium / 9603N / Solar / Beacon | - | - | 5.5V / MAX | + | + | Supercapacitor / 10F 2.7V | Supercapacitor / 10F 2.7V | -